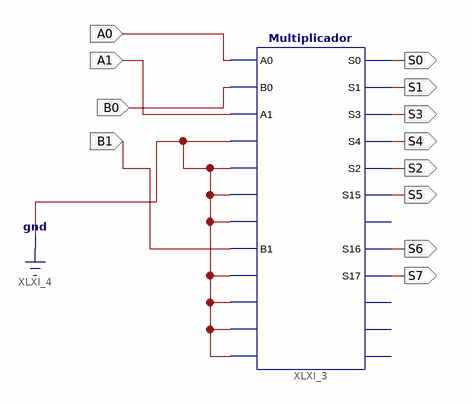
[diagram p0: schematic sheet 1]
// Xilinx ISE schematic Calculadora.sch (spartan3e) as structural Verilog: 1 symbols, 12 ports
module Calculadora (
  input  A0,
  input  A1,
  input  B0,
  input  B1,
  output S0,
  output S1,
  output S3,
  output S4,
  output S2,
  output S5,
  output S6,
  output S7
);

  Multiplicador XLXI_3 (
    .A0(A0), .B0(B0), .A1(A1), .A2(1'b0), .A3(1'b0), .A4(1'b0), .A5(1'b0), .B1(B1), .B2(1'b0), .B3(1'b0),
    .B4(1'b0), .B5(1'b0), .S0(S0), .S1(S1), .S3(S3), .S4(S4), .S2(S2), .S15(S5), .S16(S6), .S17(S7));  // open: Cout, S18, S19, S10
endmodule
